# Altium schematic sheet AmpSheet.SchDoc
size A3
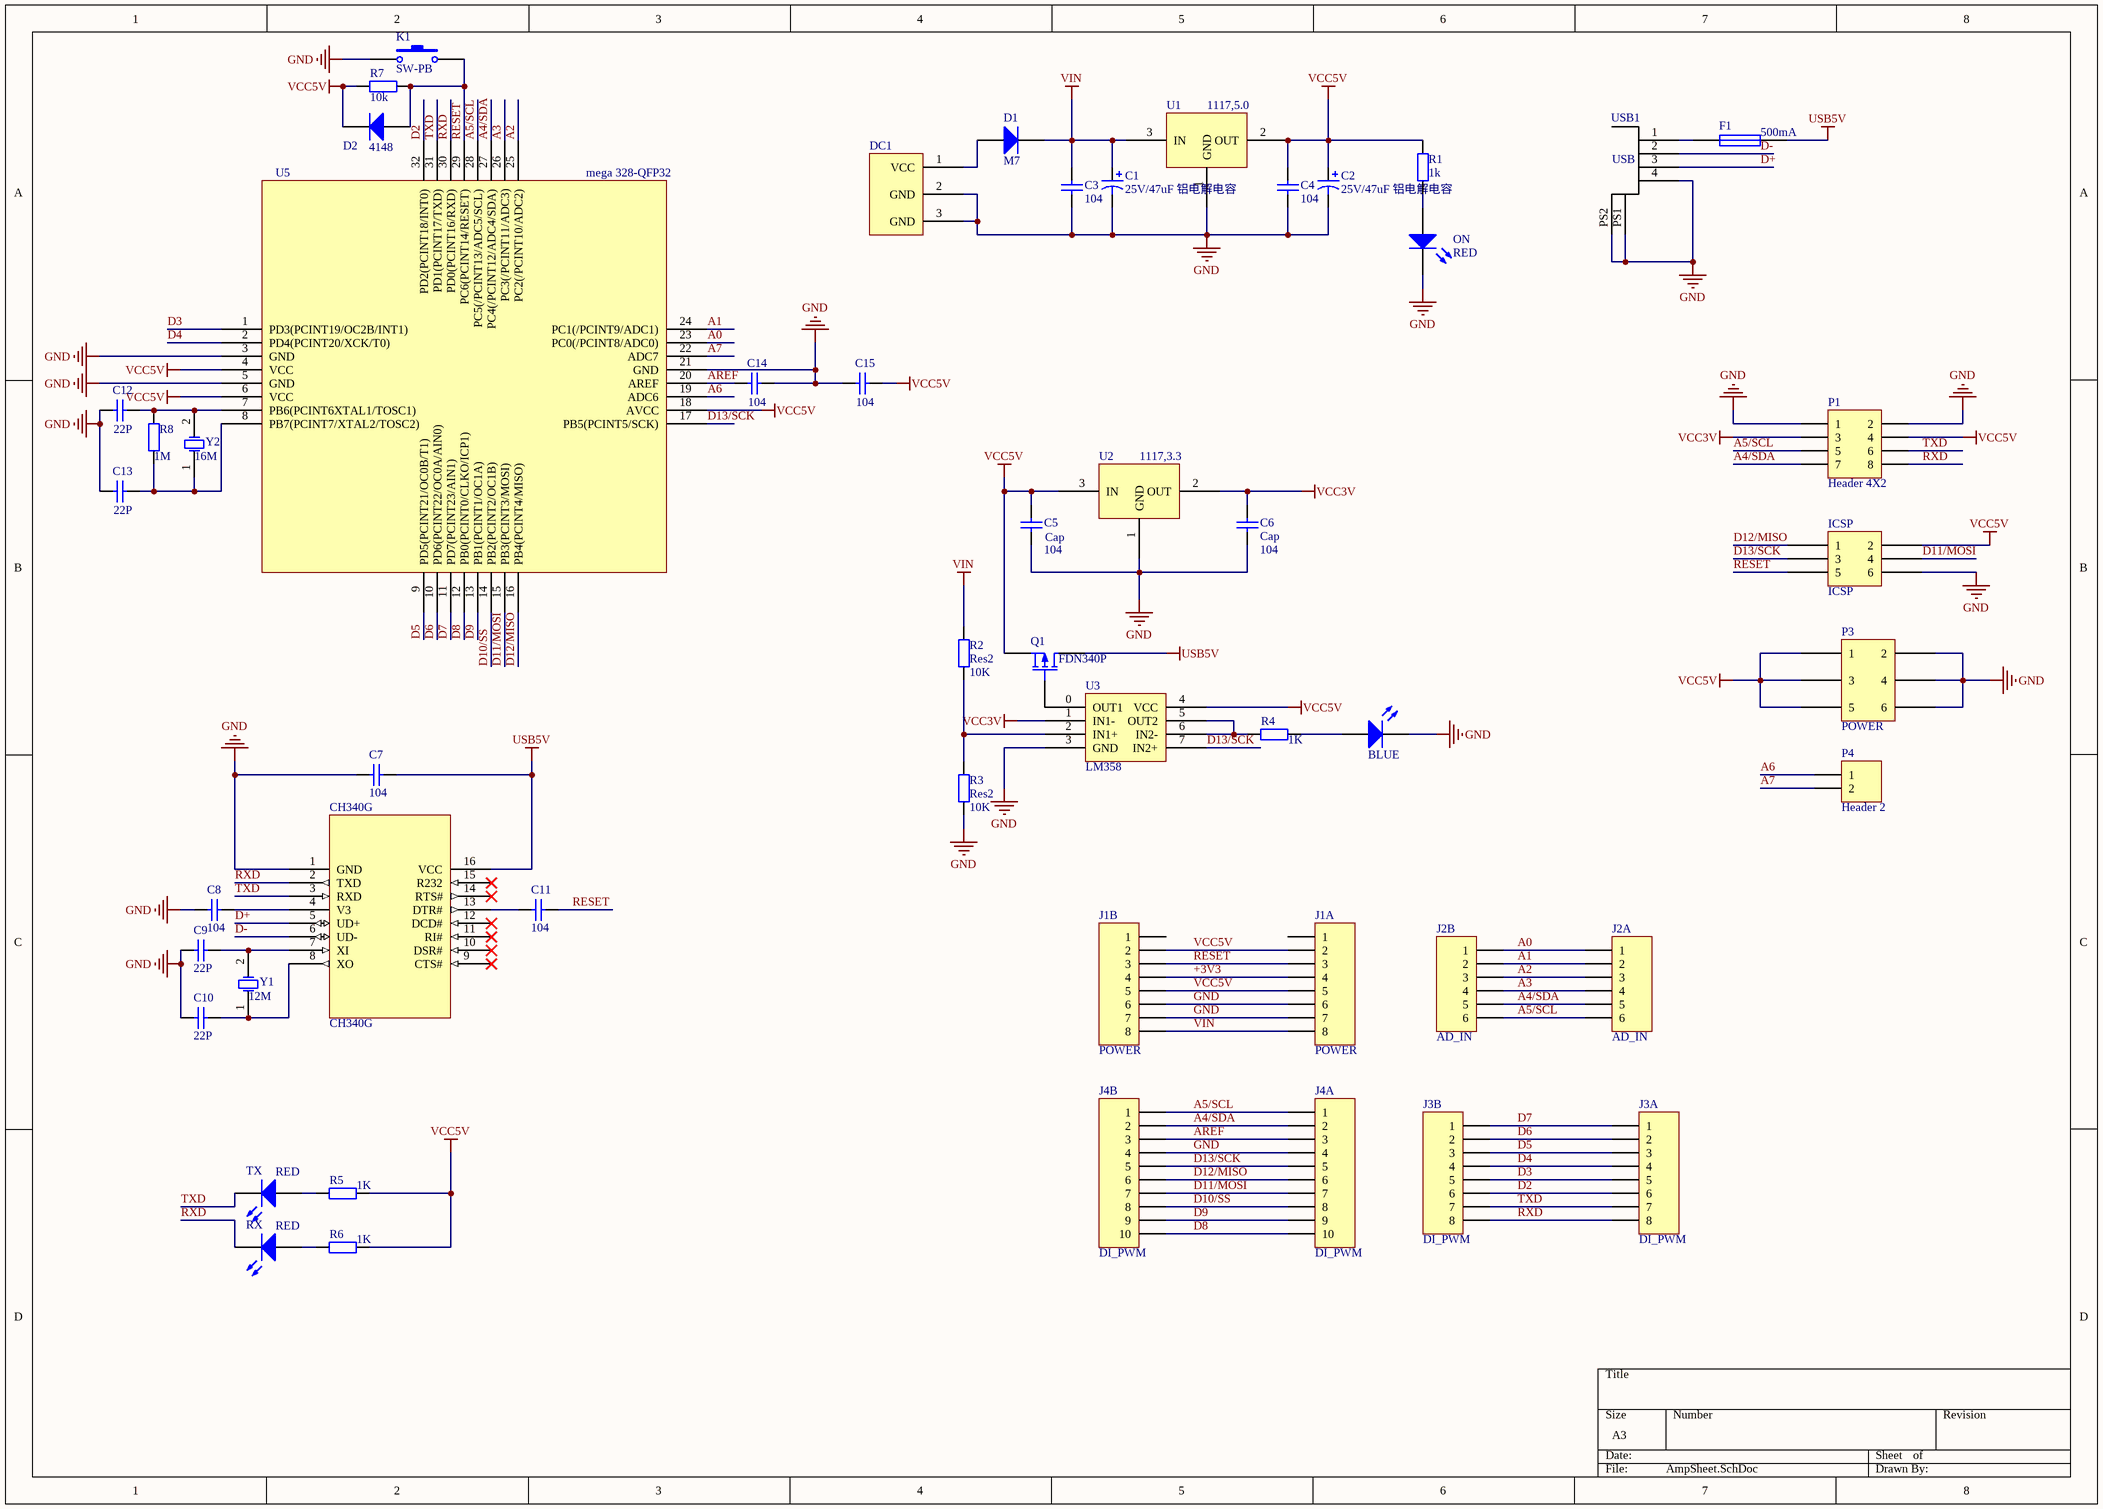
[diagram p0: AmpSheet.SchDoc]

## Parts
?  BLUE  [3.5X2.8X1.9]
C1  25V/47uF 铝电解电容  [C_47uF]
C2  25V/47uF 铝电解电容  [C_47uF]
C3  value 104  [C0805]  (hidden comment: Cap)
C4  value 104  [C0805]  (hidden comment: Cap)
C5  Cap  value 104  [C0805]
C6  Cap  value 104  [C0805]
C7  value 104  [C0805]  (hidden comment: Cap)
C8  value 104  [C0805]  (hidden comment: Cap)
C9  value 22P  [C0805]  (hidden comment: Cap)
C10  value 22P  [C0805]  (hidden comment: Cap)
C11  value 104  [C0805]  (hidden comment: Cap)
C12  value 22P  [C0805]  (hidden comment: Cap)
C13  value 22P  [C0805]  (hidden comment: Cap)
C14  value 104  [C0805]  (hidden comment: Cap)
C15  value 104  [C0805]  (hidden comment: Cap)
CH340G  CH340G  [SOP-16]
D1  M7  [SMA(DO-214AC)]
D2  4148  [1206]
DC1  DC  [DC_5.5插座]  (value not drawn)
F1  500mA  [0805]
ICSP  ICSP  [HDR2X3]
J1A  POWER  [HDR1X8]
J1B  POWER  [HDR1X8]
J2A  AD_IN  [HDR1X6]
J2B  AD_IN  [HDR1X6]
J3A  DI_PWM  [HDR1X8]
J3B  DI_PWM  [HDR1X8]
J4A  DI_PWM  [HDR1X10]
J4B  DI_PWM  [HDR1X10]
K1  SW-PB  [KEY6x6]
ON  RED  [0805]
P1  Header 4X2  [HDR2X4]
P3  POWER  [HDR2X3]
P4  Header 2  [HDR1X2]
Q1  FDN340P  [SOT23_L]
R1  value 1k  [0805]  (hidden comment: Res2)
R2  Res2  value 10K  [0805]
R3  Res2  value 10K  [0805]
R4  value 1K  [0805]  (hidden comment: Res2)
R5  value 1K  [0805]  (hidden comment: Res2)
R6  value 1K  [0805]  (hidden comment: Res2)
R7  value 10k  [0805]  (hidden comment: Res2)
R8  value 1M  [0805]  (hidden comment: Res2)
RX  RED  [0805]
TX  RED  [0805]
U1  1117,5.0  [SOT223_L]
U2  1117,3.3  [SOT223_L]
U3  LM358  [SOP-8]
U5  mega 328-QFP32  [32A_L]
USB1  USB  [PN61729]
Y1  12M  [HC_49SMD]
Y2  16M  [HC_49SMD]

## Nets
GND: ?.2(K) C1.2 C2.2 C3.2 C4.2 C5.1 C6.1 C7.1 C8.1 C9.1 C10.1 C12.2 C13.2 C14.1 C15.2 CH340G.1(GND) DC1.2(GND) DC1.3(GND) ICSP.6 J1A.6 J1A.7 J1B.6 J1B.7 J4A.4 J4B.4 K1.1 ON.2(K) P1.1 P1.2 P3.2 P3.4 P3.6 R3.1 U1.1(GND) U2.1(GND) U3.3(GND) U5.3(GND) U5.5(GND) U5.21(GND) USB1.4 USB1.PS1 USB1.PS2
USB5V: C7.2 CH340G.16(VCC) F1.2 Q1.1(D)
VCC3V: C6.2 P1.3 U2.2(OUT) U3.1(IN1-)
VCC5V: C2.1 C4.1 C5.2 C15.1 D2.2(K) ICSP.2 J1A.2 J1A.5 J1B.2 J1B.5 P1.4 P3.1 P3.3 P3.5 Q1.3(S) R1.1 R5.2 R6.2 R7.2 U1.2(OUT) U2.3(IN) U3.4(VCC) U5.4(VCC) U5.6(VCC) U5.18(AVCC)
VIN: C1.1 C3.1 D1.2(K) J1A.8 J1B.8 R2.2 U1.3(IN)
+3V3: J1A.4 J1B.4
A0: J2A.1 J2B.1 U5.23(PC0(/PCINT8/ADC0))
A1: J2A.2 J2B.2 U5.24(PC1(/PCINT9/ADC1))
A2: J2A.3 J2B.3 U5.25(PC2(/PCINT10/ADC2))
A3: J2A.4 J2B.4 U5.26(PC3(/PCINT11/ADC3))
A4/SDA: J2A.5 J2B.5 J4A.2 J4B.2 P1.7 U5.27(PC4(/PCINT12/ADC4/SDA))
A5/SCL: J2A.6 J2B.6 J4A.1 J4B.1 P1.5 U5.28(PC5(/PCINT13/ADC5/SCL))
A6: P4.1 U5.19(ADC6)
A7: P4.2 U5.22(ADC7)
AREF: C14.2 J4A.3 J4B.3 U5.20(AREF)
D2: J3A.6 J3B.6 U5.32(PD2(PCINT18/INT0))
D3: J3A.5 J3B.5 U5.1(PD3(PCINT19/OC2B/INT1))
D4: J3A.4 J3B.4 U5.2(PD4(PCINT20/XCK/T0))
D5: J3A.3 J3B.3 U5.9(PD5(PCINT21/OC0B/T1))
D6: J3A.2 J3B.2 U5.10(PD6(PCINT22/OC0A/AIN0))
D7: J3A.1 J3B.1 U5.11(PD7(PCINT23/AIN1))
D8: J4A.10 J4B.10 U5.12(PB0(PCINT0/CLKO/ICP1))
D9: J4A.9 J4B.9 U5.13(PB1(PCINT1/OC1A))
D10/SS: J4A.8 J4B.8 U5.14(PB2(PCINT2/OC1B))
D11/MOSI: ICSP.4 J4A.7 J4B.7 U5.15(PB3(PCINT3/MOSI))
D12/MISO: ICSP.1 J4A.6 J4B.6 U5.16(PB4(PCINT4/MISO))
D13/SCK: ICSP.3 J4A.5 J4B.5 U3.7(IN2+) U5.17(PB5(PCINT5/SCK))
D+: CH340G.5(UD+) USB1.3
D-: CH340G.6(UD-) USB1.2
RESET: C11.2 D2.1(A) ICSP.5 J1A.3 J1B.3 K1.2 R7.1 U5.29(PC6(PCINT14/RESET))
RXD: CH340G.2(TXD) J3A.8 J3B.8 P1.8 RX.2(K) U5.30(PD0(PCINT16/RXD))
TXD: CH340G.3(RXD) J3A.7 J3B.7 P1.6 TX.2(K) U5.31(PD1(PCINT17/TXD))
Net?_1: ?.1(A) R4.1
NetC8_2: C8.2 CH340G.4(V3)
NetC9_2: C9.2 CH340G.7(XI) Y1.2(OSC2)
NetC10_2: C10.2 CH340G.8(XO) Y1.1(OSC1)
NetC11_1: C11.1 CH340G.13(DTR#)
NetC12_1: C12.1 R8.2 U5.7(PB6(PCINT6XTAL1/TOSC1)) Y2.2(OSC2)
NetC13_1: C13.1 R8.1 U5.8(PB7(PCINT7/XTAL2/TOSC2)) Y2.1(OSC1)
NetD1_1: D1.1(A) DC1.1(VCC)
NetF1_1: F1.1 USB1.1
NetON_1: ON.1(A) R1.2
NetQ1_2: Q1.2(G) U3.0(OUT1)
NetR2_1: R2.1 R3.2 U3.2(IN1+)
NetR4_2: R4.2 U3.5(OUT2) U3.6(IN2-)
NetR5_1: R5.1 TX.1(A)
NetR6_1: R6.1 RX.1(A)

Not connected (* = marked no-connect by the designer): CH340G 9(CTS#)* 10(DSR#)* 11(RI#)* 12(DCD#)* 14(RTS#)* 15(R232)*; J1A 1; J1B 1

## Library data of the parts
? = LED3: Typical BLUE SiC LED; Published: 8-Jun-2000; LatestRevisionDate: 17-Dec-2003; LatestRevisionNote: PCB Footprint replaced.; DatasheetVersion: 16-Apr-2002; PackageVersion: 16-Apr-2002; PackageReference: 3.5X2.8X1.9; Publisher: Altium Limited; PackageDescription: SM LED; 2 C-Bend Leads; Body 3.5 x 2.8 x 1.9 mm, inc leads (LxWxH typ)
C1 C2 = Cap Pol1: Polarized Capacitor (Radial); Value: 100pF; Published: 8-Jun-2000; LatestRevisionDate: 17-Jul-2002; LatestRevisionNote: Re-released for DXP Platform.; PackageReference: RB7.6-15; Publisher: Altium Limited; PackageDescription: Polarized Capacitor (Radial); 2 Leads
C3-C15 = Cap: Capacitor; Published: 8-Jun-2000; LatestRevisionDate: 17-Jul-2002; LatestRevisionNote: Re-released for DXP Platform.; PackageReference: C0805; Publisher: Altium Limited; PackageDescription: Radial Cap, Thru-Hole; 2 Leads; 0.3 in Pin Spacing
D1 D2 = Diode 1N4148: High Conductance Fast Diode; Published: 8-Jun-2000; LatestRevisionDate: 17-Jul-2002; LatestRevisionNote: Re-released for DXP Platform.; DatasheetVersion: 1997; PackageReference: DO-35; Publisher: Altium Limited; PackageDescription: Diode, Axial; Body 3.8 x 1.9 mm (LxDia. max), Lead Dia. 0.53 mm (max); Code_JEDEC: DO-204-AH; ComponentLink1Description: Manufacturer Link; ComponentLink1URL: http://www.fairchildsemi.com/; ComponentLink2Description: Datasheet; ComponentLink2URL: http://www.fairchildsemi.com/ds/1N%2F1N4148.pdf
F1 = Fuse 1: Fuse; Published: 8-Jun-2000; LatestRevisionDate: 17-Jul-2002; LatestRevisionNote: Re-released for DXP Platform.; PackageReference: PIN-W2/E2.8; Publisher: Altium Limited; PackageDescription: Thru-Hole; 2 Leads
J1A J1B J3A J3B = MHDR1X8: Header, 8-Pin; LatestRevisionDate: 17-Jul-2002; LatestRevisionNote: Re-released for DXP Platform.; Publisher: Altium Limited
J2A J2B = MHDR1X6: Header, 6-Pin; LatestRevisionDate: 17-Jul-2002; LatestRevisionNote: Re-released for DXP Platform.; Publisher: Altium Limited
J4A J4B = MHDR1X10: Header, 10-Pin; LatestRevisionDate: 17-Jul-2002; LatestRevisionNote: Re-released for DXP Platform.; Publisher: Altium Limited
K1 = SW-PB: Switch; Published: 24-Mar-1999; LatestRevisionDate: 17-Jul-2002; LatestRevisionNote: Re-released for DXP Platform.; PackageReference: SPST-2; Publisher: Altium Limited; PackageDescription: Switch; 2 Leads
ON RX TX = LED2: Typical RED, GREEN, YELLOW, AMBER GaAs LED; Published: 8-Jun-2000; LatestRevisionDate: 17-Jul-2002; LatestRevisionNote: Re-released for DXP Platform.; PackageVersion: Feb-2002; PackageReference: 3.2X1.6X1.1; Publisher: Altium Limited; PackageDescription: SM LED; 2 Flat Leads
P1 = Header 4X2: Header, 4-Pin, Dual row; LatestRevisionDate: 17-Jul-2002; LatestRevisionNote: Re-released for DXP Platform.; Publisher: Altium Limited
P4 = Header 2: Header, 2-Pin; LatestRevisionDate: 17-Jul-2002; LatestRevisionNote: Re-released for DXP Platform.; Publisher: Altium Limited
Q1 = MOSFET-P: P-Channel MOSFET; Published: 8-Jun-2000; LatestRevisionDate: 17-Jul-2002; LatestRevisionNote: Re-released for DXP Platform.; PackageVersion: 1995/1996; PackageReference: E3; Publisher: Altium Limited; PackageDescription: TO, Flat Index; 3 In-Line, Axial Leads; Body Dia. 4.6mm; Lead Dia. 0.5 mm (max)
R1-R8 = Res2: Resistor; Published: 8-Jun-2000; LatestRevisionDate: 17-Jul-2002; LatestRevisionNote: Re-released for DXP Platform.; PackageReference: AXIAL-0.4; Publisher: Altium Limited; PackageDescription: Axial Device, Thru-Hole; 2 Leads; 0.4 in Pin Spacing
U1 U2 = LM1117
U5 = QFP-32
Y1 Y2 = XTAL: Crystal Oscillator; Published: 8-Jun-2000; LatestRevisionDate: 17-Jul-2002; LatestRevisionNote: Re-released for DXP Platform.; PackageReference: R38; Publisher: Altium Limited; PackageDescription: Crystal, Thru-Hole; 2 Leads; Body 3.1 x 8.2 mm (Dia.xH)